# Altium schematic sheet ADC_IN.SchDoc
size A4
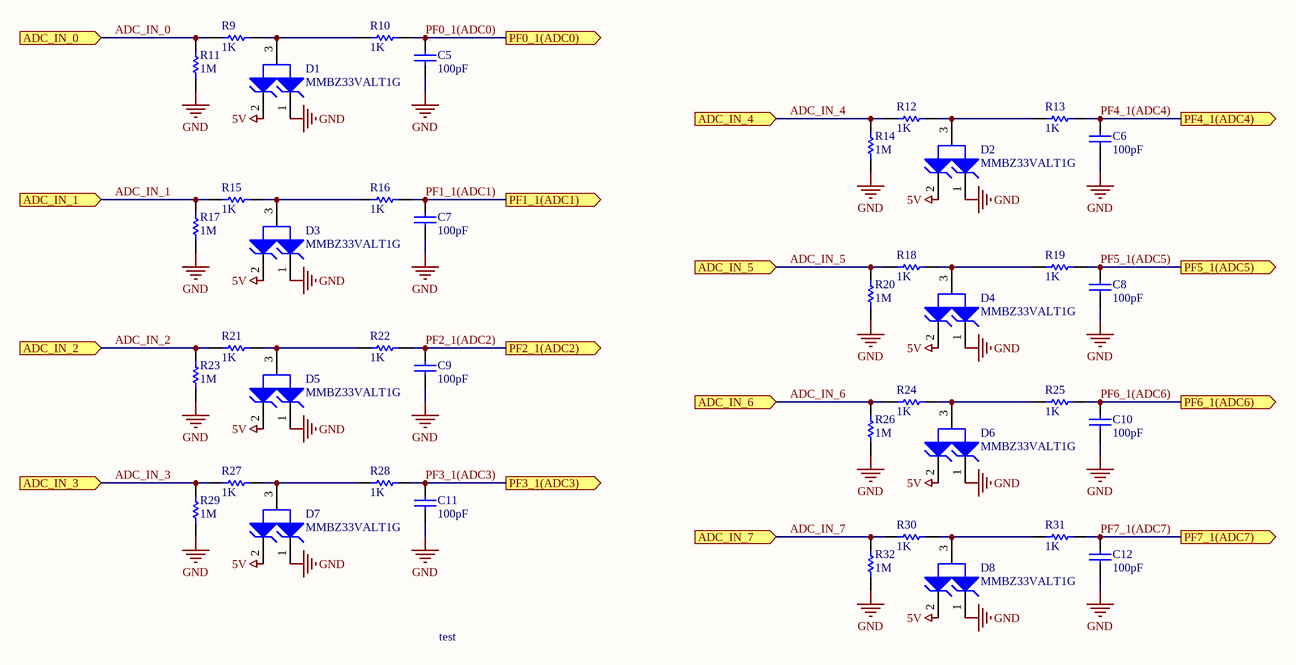
[diagram p0: ADC_IN.SchDoc]

## Parts
C5  100pF  [CAPC2013X140X50NL20T25]
C6  100pF  [CAPC2013X140X50NL20T25]
C7  100pF  [CAPC2013X140X50NL20T25]
C8  100pF  [CAPC2013X140X50NL20T25]
C9  100pF  [CAPC2013X140X50NL20T25]
C10  100pF  [CAPC2013X140X50NL20T25]
C11  100pF  [CAPC2013X140X50NL20T25]
C12  100pF  [CAPC2013X140X50NL20T25]
D1  MMBZ33VALT1G  [ONSC-SOT-23-3-318-08_V]
D2  MMBZ33VALT1G  [ONSC-SOT-23-3-318-08_V]
D3  MMBZ33VALT1G  [ONSC-SOT-23-3-318-08_V]
D4  MMBZ33VALT1G  [ONSC-SOT-23-3-318-08_V]
D5  MMBZ33VALT1G  [ONSC-SOT-23-3-318-08_V]
D6  MMBZ33VALT1G  [ONSC-SOT-23-3-318-08_V]
D7  MMBZ33VALT1G  [ONSC-SOT-23-3-318-08_V]
D8  MMBZ33VALT1G  [ONSC-SOT-23-3-318-08_V]
R9  1K  [RESC2113X50X35ML15T15]
R10  1K  [RESC2113X50X35ML15T15]
R11  1M  [RESC2113X50X35ML15T15]
R12  1K  [RESC2113X50X35ML15T15]
R13  1K  [RESC2113X50X35ML15T15]
R14  1M  [RESC2113X50X35ML15T15]
R15  1K  [RESC2113X50X35ML15T15]
R16  1K  [RESC2113X50X35ML15T15]
R17  1M  [RESC2113X50X35ML15T15]
R18  1K  [RESC2113X50X35ML15T15]
R19  1K  [RESC2113X50X35ML15T15]
R20  1M  [RESC2113X50X35ML15T15]
R21  1K  [RESC2113X50X35ML15T15]
R22  1K  [RESC2113X50X35ML15T15]
R23  1M  [RESC2113X50X35ML15T15]
R24  1K  [RESC2113X50X35ML15T15]
R25  1K  [RESC2113X50X35ML15T15]
R26  1M  [RESC2113X50X35ML15T15]
R27  1K  [RESC2113X50X35ML15T15]
R28  1K  [RESC2113X50X35ML15T15]
R29  1M  [RESC2113X50X35ML15T15]
R30  1K  [RESC2113X50X35ML15T15]
R31  1K  [RESC2113X50X35ML15T15]
R32  1M  [RESC2113X50X35ML15T15]

## Ports
ADC_IN_0 (in), ADC_IN_1 (in), ADC_IN_2 (in), ADC_IN_3 (in), ADC_IN_4 (in), ADC_IN_5 (in), ADC_IN_6 (in), ADC_IN_7 (in), PF0_1(ADC0) (out), PF1_1(ADC1) (out), PF2_1(ADC2) (out), PF3_1(ADC3) (out), PF4_1(ADC4) (out), PF5_1(ADC5) (out), PF6_1(ADC6) (out), PF7_1(ADC7) (out)

## Nets
5V: D1.2(K2) D2.2(K2) D3.2(K2) D4.2(K2) D5.2(K2) D6.2(K2) D7.2(K2) D8.2(K2)
GND: C5.2 C6.2 C7.2 C8.2 C9.2 C10.2 C11.2 C12.2 D1.1(K1) D2.1(K1) D3.1(K1) D4.1(K1) D5.1(K1) D6.1(K1) D7.1(K1) D8.1(K1) R11.2 R14.2 R17.2 R20.2 R23.2 R26.2 R29.2 R32.2
ADC_IN_0: R9.2 R11.1 ; port ADC_IN_0
ADC_IN_1: R15.2 R17.1 ; port ADC_IN_1
ADC_IN_2: R21.2 R23.1 ; port ADC_IN_2
ADC_IN_3: R27.2 R29.1 ; port ADC_IN_3
ADC_IN_4: R12.2 R14.1 ; port ADC_IN_4
ADC_IN_5: R18.2 R20.1 ; port ADC_IN_5
ADC_IN_6: R24.2 R26.1 ; port ADC_IN_6
ADC_IN_7: R30.2 R32.1 ; port ADC_IN_7
PF0_1(ADC0): C5.1 R10.1 ; port PF0_1(ADC0)
PF1_1(ADC1): C7.1 R16.1 ; port PF1_1(ADC1)
PF2_1(ADC2): C9.1 R22.1 ; port PF2_1(ADC2)
PF3_1(ADC3): C11.1 R28.1 ; port PF3_1(ADC3)
PF4_1(ADC4): C6.1 R13.1 ; port PF4_1(ADC4)
PF5_1(ADC5): C8.1 R19.1 ; port PF5_1(ADC5)
PF6_1(ADC6): C10.1 R25.1 ; port PF6_1(ADC6)
PF7_1(ADC7): C12.1 R31.1 ; port PF7_1(ADC7)
NetD1_3: D1.3(A) R9.1 R10.2
NetD2_3: D2.3(A) R12.1 R13.2
NetD3_3: D3.3(A) R15.1 R16.2
NetD4_3: D4.3(A) R18.1 R19.2
NetD5_3: D5.3(A) R21.1 R22.2
NetD6_3: D6.3(A) R24.1 R25.2
NetD7_3: D7.3(A) R27.1 R28.2
NetD8_3: D8.3(A) R30.1 R31.2

## Notes on the sheet
- test
- Title
- Size:
- Date:
- A4
- Number:
- Time:
- Revision:
- Sheet
- of
- File:

## Library data of the parts
C5-C12 = CAP: Manufacturer: AVX Interconnect / Elco; Part Number: 08051A102JAT2A
D1-D8 = ONSC-K1K2A3-3: 40 W Peak Power Zener Transient Voltage Suppressor, Dual Common Anode Zeners for ESD Protection, 3-Pin SOT-23, Pb-Free, Tape and Reel; Manufacturer: On Semiconductor; Direction: Unidirectional; PPK Max (W): 40; IR Max (uA): 0.05; V(BR) Typ (V): 33; PackageReference: SOT-23-3-318-08; RoHS: Pb-Free; PackageDescription: 3-Pin Small Outline Transistor, Body 2.92 x 1.3 mm, Pitch 0.95 mm; Mounting Technology: Surface Mount; PackageVersion: Rev. AP, 11/2009; PartNumber: MMBZ33VALT1G; ComponentLink2Description: Datasheet; DatasheetVersion: Rev. 13; ComponentLink3Description: Package Specification; ComponentLink1Description: Manufacturer URL; Packing: Tape and Reel; ComponentLink3URL: http://www.onsemi.cn/pub_link/Collateral/318-08.PDF; ComponentLink2URL: http://www.onsemi.com/pub_link/Collateral/MMBZ5V6ALT1-D.PDF; ComponentLink1URL: http://www.onsemi.com/
R9-R32 = RES-2: Chip Resistor, 4.7 KOhm, +/- 1%, 0.125 W, -55 to 155 degC, 0805 (2012 Metric), RoHS, Tape and Reel; Manufacturer: Vishay Semiconductor; Temperature Coefficient: 100ppm/degreesC; Voltage Rating: 150V; Max Power Dissipation: 125mW; Packaging: TapeandReel; Max Operating Temperature: 155degC; Case Code (Imperial): 0805; Case/Package: 0805; Radiation Hardening: No; Package Reference: 0805; Lead Free: LeadFree; Package Description: 2-Pin Surface Mount Device, Body 2.05 x 1.25 mm; Manufacturer URL: http://www.vishay.com/; Tolerance: 1%; Height: 0.45mm; REACH SVHC: Unknown; Termination: SMD/SMT; Length: 2mm; Depth: 1.25mm; Case Code (Metric): 2012; Package Quantity: 10; Weight: 0.000194oz; Military Standard: Not; RoHSCompliant: true; Composition: ThickFilm; Contact Plating: Tin; Datasheet Version: 41061.0; Datasheet URL: https://datasheet.ciiva.com/11808/0900766b80d98b26-11808992.pdf; Width: 1.25mm; Number of Terminations: 2; Min Operating Temperature: -55degC; Power Rating: 125mW; Resistance: 4.7KOhm; Voltage Rating (DC): 150V